# EAGLE design control pcb rev1-1 (EAGLE 6.1)

## Sheet 1 of 6
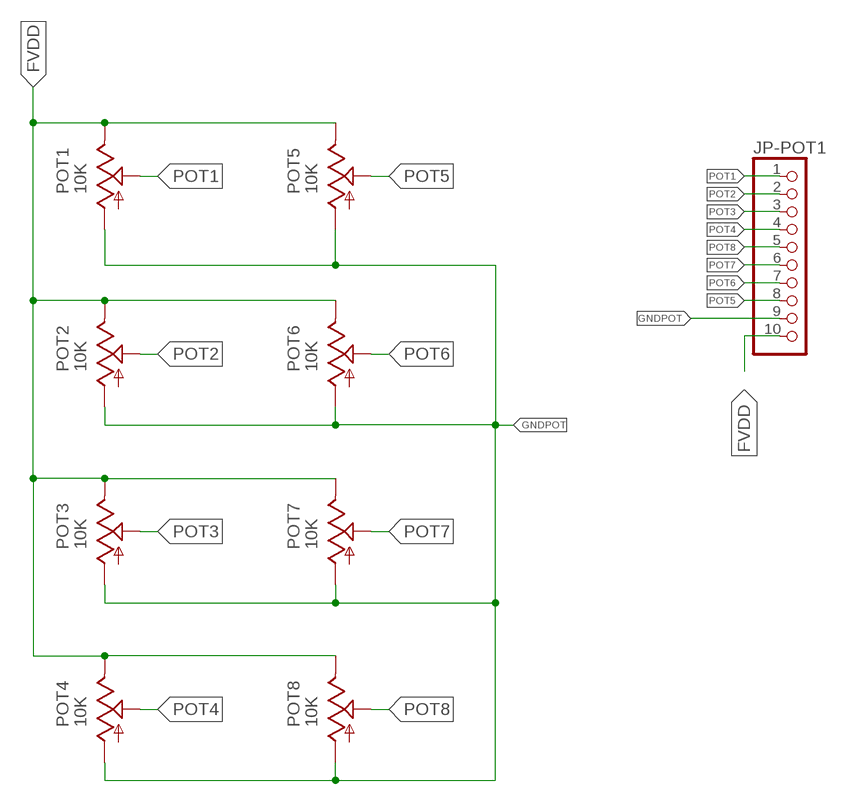
[diagram p0: schematic, sheet 1]

### Parts
JP-POT1  PINHD-1X10_2.54  [1X10]
POT1  10K  9MM_SNAP-IN_POT_  [9MM_SNAP-IN_POT]
POT2  10K  9MM_SNAP-IN_POT_  [9MM_SNAP-IN_POT]
POT3  10K  9MM_SNAP-IN_POT_  [9MM_SNAP-IN_POT]
POT4  10K  9MM_SNAP-IN_POT_  [9MM_SNAP-IN_POT]
POT5  10K  9MM_SNAP-IN_POT_  [9MM_SNAP-IN_POT]
POT6  10K  9MM_SNAP-IN_POT_  [9MM_SNAP-IN_POT]
POT7  10K  9MM_SNAP-IN_POT_  [9MM_SNAP-IN_POT]
POT8  10K  9MM_SNAP-IN_POT_  [9MM_SNAP-IN_POT]

### Nets
FVDD: JP-POT1.10 POT1.3(E) POT2.3(E) POT3.3(E) POT4.3(E) POT5.3(E) POT6.3(E) POT7.3(E) POT8.3(E)
GNDPOT: JP-POT1.9 POT1.1(A) POT2.1(A) POT3.1(A) POT4.1(A) POT5.1(A) POT6.1(A) POT7.1(A) POT8.1(A)
POT1: JP-POT1.1 POT1.2(S)
POT2: JP-POT1.2 POT2.2(S)
POT3: JP-POT1.3 POT3.2(S)
POT4: JP-POT1.4 POT4.2(S)
POT5: JP-POT1.8 POT5.2(S)
POT6: JP-POT1.7 POT6.2(S)
POT7: JP-POT1.6 POT7.2(S)
POT8: JP-POT1.5 POT8.2(S)

## Sheet 2 of 6
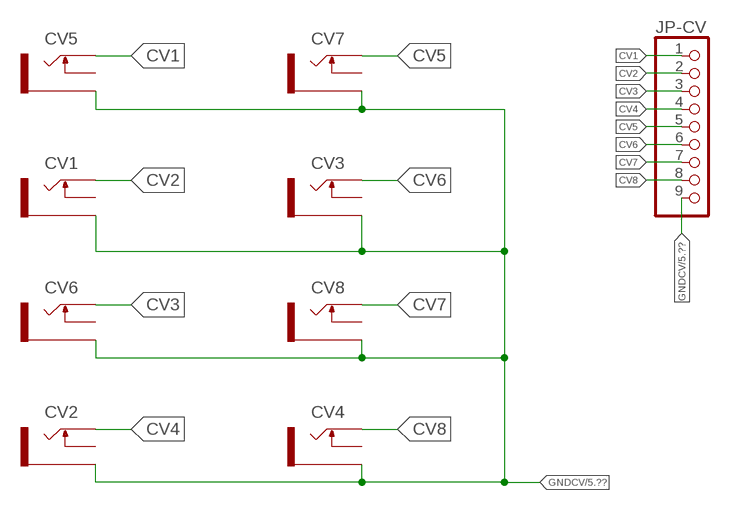
[diagram p1: schematic, sheet 2]

### Parts
CV1  THONKICONNNEW  [WQP-PJ301M-12_JACK]
CV2  THONKICONNNEW  [WQP-PJ301M-12_JACK]
CV3  THONKICONNNEW  [WQP-PJ301M-12_JACK]
CV4  THONKICONNNEW  [WQP-PJ301M-12_JACK]
CV5  THONKICONNNEW  [WQP-PJ301M-12_JACK]
CV6  THONKICONNNEW  [WQP-PJ301M-12_JACK]
CV7  THONKICONNNEW  [WQP-PJ301M-12_JACK]
CV8  THONKICONNNEW  [WQP-PJ301M-12_JACK]
JP-CV  PINHD-1X9_2.54  [1X09]

### Nets
CV1: CV5.P$1_TIP(TIP) JP-CV.1
CV2: CV1.P$1_TIP(TIP) JP-CV.2
CV3: CV6.P$1_TIP(TIP) JP-CV.3
CV4: CV2.P$1_TIP(TIP) JP-CV.4
CV5: CV7.P$1_TIP(TIP) JP-CV.5
CV6: CV3.P$1_TIP(TIP) JP-CV.6
CV7: CV8.P$1_TIP(TIP) JP-CV.7
CV8: CV4.P$1_TIP(TIP) JP-CV.8
GNDCV: CV1.P$3_SLEEVE(SLEEVE) CV2.P$3_SLEEVE(SLEEVE) CV3.P$3_SLEEVE(SLEEVE) CV4.P$3_SLEEVE(SLEEVE) CV5.P$3_SLEEVE(SLEEVE) CV6.P$3_SLEEVE(SLEEVE) CV7.P$3_SLEEVE(SLEEVE) CV8.P$3_SLEEVE(SLEEVE) JP-CV.9 ; also sheet 5
Unconnected: CV1.P$2_SWITCH(SWITCH) CV2.P$2_SWITCH(SWITCH) CV3.P$2_SWITCH(SWITCH) CV4.P$2_SWITCH(SWITCH) CV5.P$2_SWITCH(SWITCH) CV6.P$2_SWITCH(SWITCH) CV7.P$2_SWITCH(SWITCH) CV8.P$2_SWITCH(SWITCH)

## Sheet 3 of 6
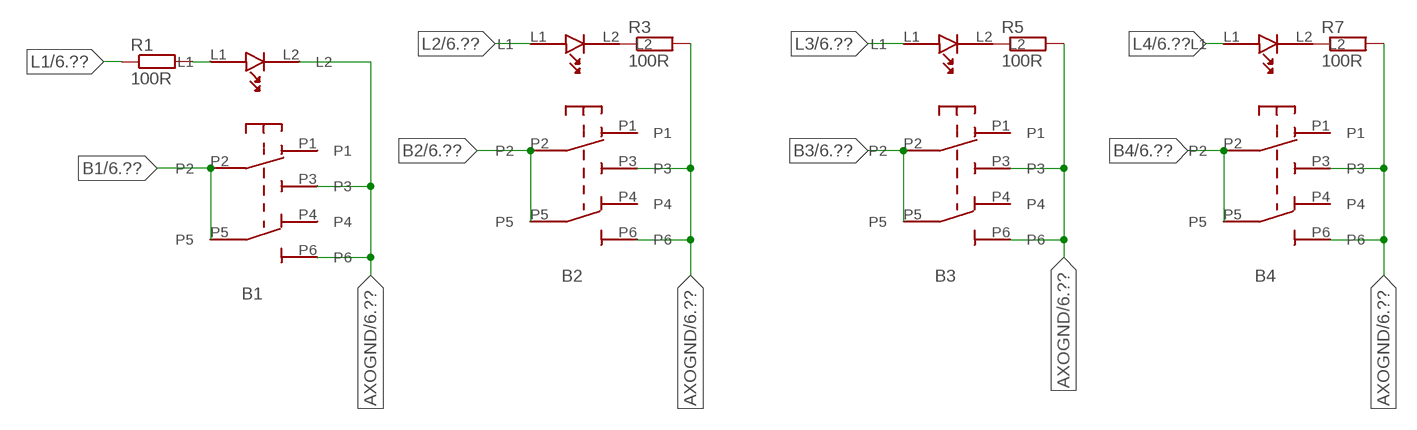
[diagram p2: schematic, sheet 3]

### Parts
B1  LP4OA1PBCTG/D6  LP4OA1PBCTG  [LP4OA1PBCT]
B2  LP4OA1PBCTG/D6  LP4OA1PBCTG  [LP4OA1PBCT]
B3  LP4OA1PBCTG/D6  LP4OA1PBCTG  [LP4OA1PBCT]
B4  LP4OA1PBCTG/D6  LP4OA1PBCTG  [LP4OA1PBCT]
R1  100R  R-EU_0207/7  [0207/7]
R3  100R  R-EU_0207/7  [0207/7]
R5  100R  R-EU_0207/7  [0207/7]
R7  100R  R-EU_0207/7  [0207/7]

### Nets
AXOGND: B1.L2 B1.P3 B1.P6 B2.P3 B2.P6 B3.P3 B3.P6 B4.P3 B4.P6 R3.2 R5.2 R7.2 ; also sheet 6
B1: B1.P2 B1.P5 ; also sheet 6
B2: B2.P2 B2.P5 ; also sheet 6
B3: B3.P2 B3.P5 ; also sheet 6
B4: B4.P2 B4.P5 ; also sheet 6
L1: R1.1 ; also sheet 6
L2: B2.L1 ; also sheet 6
L3: B3.L1 ; also sheet 6
L4: B4.L1 ; also sheet 6
N$3: B2.L2 R3.1
N$4: B3.L2 R5.1
N$5: B1.L1 R1.2
N$6: B4.L2 R7.1
Unconnected: B1.P1 B1.P4 B2.P1 B2.P4 B3.P1 B3.P4 B4.P1 B4.P4

## Sheet 4 of 6
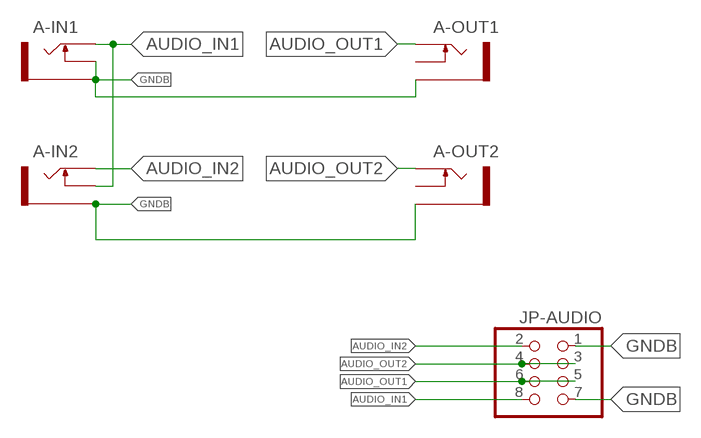
[diagram p3: schematic, sheet 4]

### Parts
A-IN1  THONKICONNNEW  [WQP-PJ301M-12_JACK]
A-IN2  THONKICONNNEW  [WQP-PJ301M-12_JACK]
A-OUT1  THONKICONNNEW  [WQP-PJ301M-12_JACK]
A-OUT2  THONKICONNNEW  [WQP-PJ301M-12_JACK]
JP-AUDIO  PINHD-2X4_2.54  [2X04]

### Nets
AUDIO_IN1: A-IN1.P$1_TIP(TIP) A-IN2.P$2_SWITCH(SWITCH) JP-AUDIO.8
AUDIO_IN2: A-IN2.P$1_TIP(TIP) JP-AUDIO.2
AUDIO_OUT1: A-OUT1.P$1_TIP(TIP) JP-AUDIO.5 JP-AUDIO.6
AUDIO_OUT2: A-OUT2.P$1_TIP(TIP) JP-AUDIO.3 JP-AUDIO.4
GNDB: A-IN1.P$2_SWITCH(SWITCH) A-IN1.P$3_SLEEVE(SLEEVE) A-IN2.P$3_SLEEVE(SLEEVE) A-OUT1.P$3_SLEEVE(SLEEVE) A-OUT2.P$3_SLEEVE(SLEEVE) JP-AUDIO.1 JP-AUDIO.7
Unconnected: A-OUT1.P$2_SWITCH(SWITCH) A-OUT2.P$2_SWITCH(SWITCH)

## Sheet 5 of 6
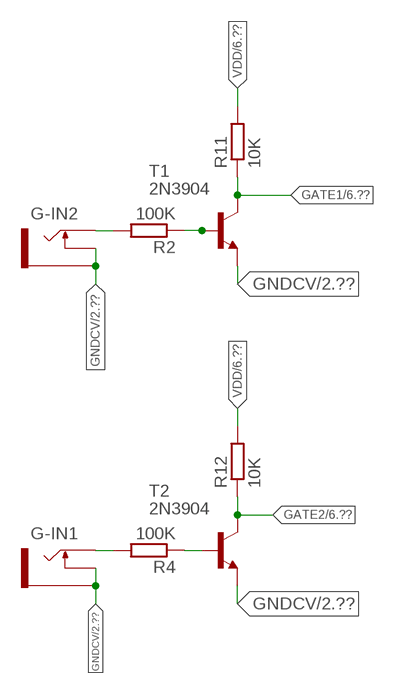
[diagram p4: schematic, sheet 5]

### Parts
G-IN1  THONKICONNNEW  [WQP-PJ301M-12_JACK]
G-IN2  THONKICONNNEW  [WQP-PJ301M-12_JACK]
R2  100K  R-EU_0207/7  [0207/7]
R4  100K  R-EU_0207/7  [0207/7]
R11  10K  R-EU_0207/7  [0207/7]
R12  10K  R-EU_0207/7  [0207/7]
T1  2N3904  [TO92]
T2  2N3904  [TO92]

### Nets
GATE1: R11.1 T1.1(C) ; also sheet 6
GATE2: R12.1 T2.1(C) ; also sheet 6
GNDCV: G-IN1.P$2_SWITCH(SWITCH) G-IN1.P$3_SLEEVE(SLEEVE) G-IN2.P$2_SWITCH(SWITCH) G-IN2.P$3_SLEEVE(SLEEVE) T1.3(E) T2.3(E) ; also sheet 2
N$7: G-IN2.P$1_TIP(TIP) R2.2
N$9: G-IN1.P$1_TIP(TIP) R4.2
N$11: R2.1 T1.2(B)
N$16: R4.1 T2.2(B)
VDD: R11.2 R12.2 ; also sheet 6

## Sheet 6 of 6
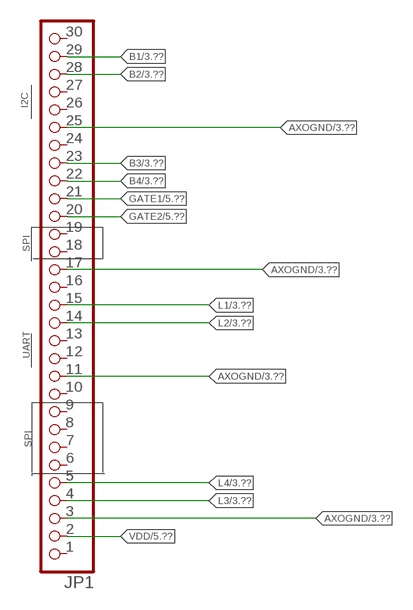
[diagram p5: schematic, sheet 6]

### Parts
JP1  PINHD-1X30  [1X30]

### Nets
AXOGND: JP1.3 JP1.11 JP1.17 JP1.25 ; also sheet 3
B1: JP1.29 ; also sheet 3
B2: JP1.28 ; also sheet 3
B3: JP1.23 ; also sheet 3
B4: JP1.22 ; also sheet 3
GATE1: JP1.21 ; also sheet 5
GATE2: JP1.20 ; also sheet 5
L1: JP1.15 ; also sheet 3
L2: JP1.14 ; also sheet 3
L3: JP1.4 ; also sheet 3
L4: JP1.5 ; also sheet 3
VDD: JP1.2 ; also sheet 5
Unconnected: JP1.1 JP1.6 JP1.7 JP1.8 JP1.9 JP1.10 JP1.12 JP1.13 JP1.16 JP1.18 JP1.19 JP1.24 JP1.26 JP1.27 JP1.30

### Notes on the sheet
- I2C
- SPI
- UART
- SPI

## Library data of the parts
A-IN1 A-IN2 A-OUT1 A-OUT2 CV1-CV8 G-IN1 G-IN2 = MusicThingModular:THONKICONN: 3.5mm socket for Eurorack modular synths
B1-B4 = og-switch:LP4OA1PBCTG
JP1 = pinhead:PINHD-1X30: PIN HEADER
JP-AUDIO = pinhead 2:PINHD-2X4: PIN HEADER
JP-CV = pinhead 2:PINHD-1X9: PIN HEADER
JP-POT1 = pinhead 2:PINHD-1X10: PIN HEADER
POT1-POT8 = MusicThingModular:9MM_SNAP-IN_POT: 9mm vertical snap-in pot, Alpha / Panasonic style
R1-R5 R7 R11 R12 = resistor-mod:R-EU_: RESISTOR, European symbol
T1 T2 = transistor-mod:2N3904: NPN TRANSISTOR

## Board
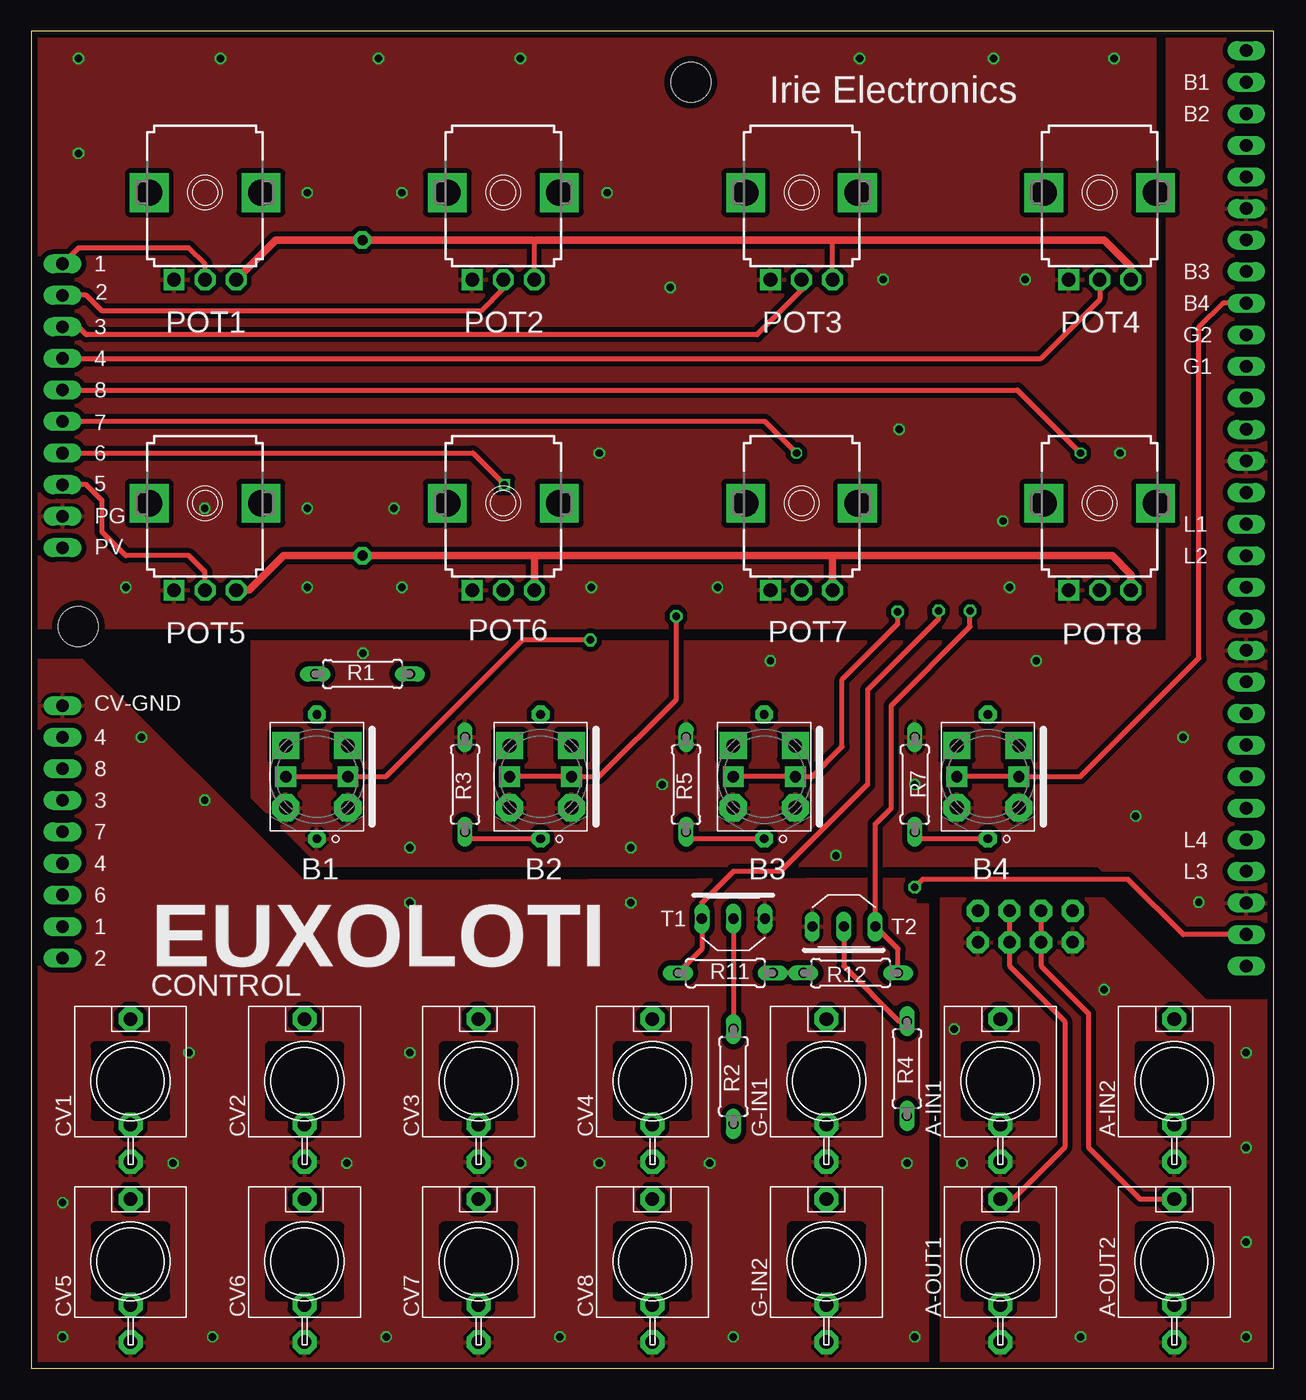
[diagram p6: board, top side]
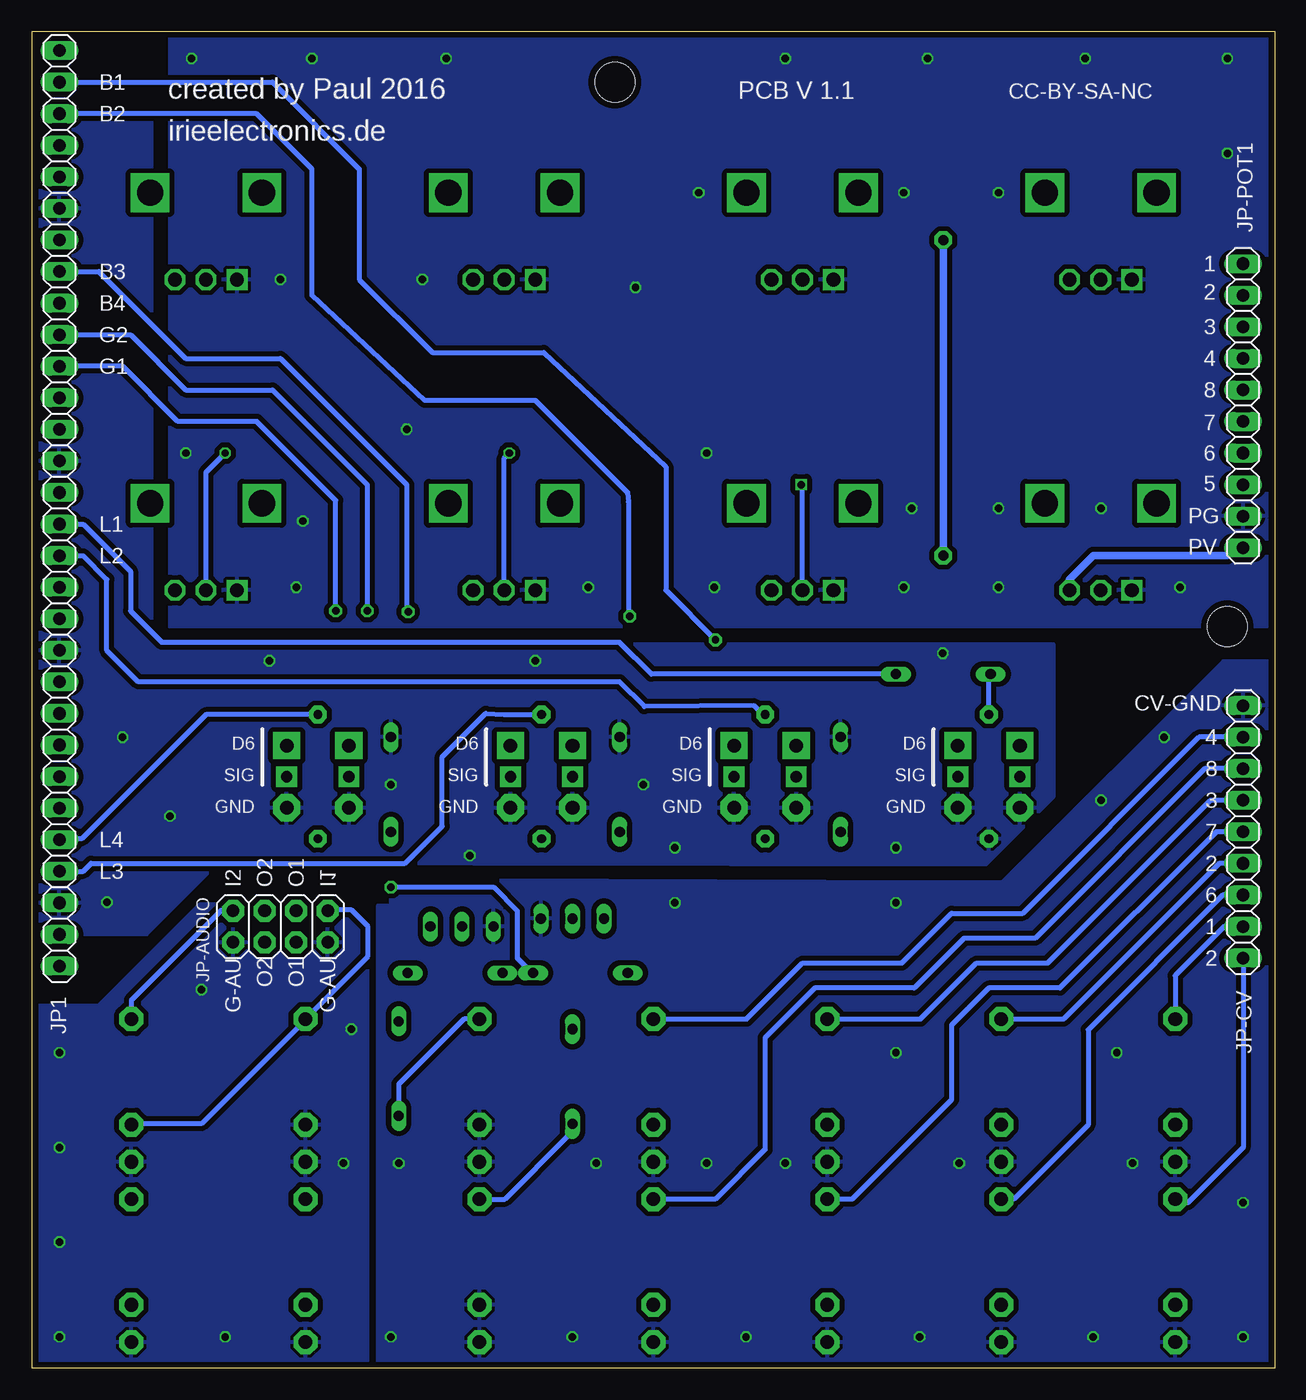
[diagram p7: board, bottom side, seen from below]

Size 100 x 107.62 mm. Coordinates in mm from the lower left corner, seen from the top.
Outline: 0,0 100,0 100,107.62 0,107.62 0,0
Copper layers (1*2*15*16): Top 0.035mm / dielectric 0.2mm / Route2 0.035mm / dielectric 1.2mm / Route15 0.035mm / dielectric 0.2mm / Bottom 0.035mm
Design rules: minimum track width 6mil, minimum drill 12mil, track to track 6mil, track to pad 8mil, pad to pad 12mil, via to via 6mil, smd to smd 0mil, copper to edge 20mil, drill to drill 10mil, minimum pad ring 6mil, minimum via ring 6mil, stop-mask expansion 0mil, vias tented up to drill 100mil, thermal gap 10mil
Holes 3.2 mm at 53.1,103.51 3.81,59.69

### Footprints (pad centres in the part's own frame; a part is rotated, then mirrored left to right if it is on the bottom)
WQP-PJ301M-12_JACK = drill 1.1 pad 1.93 octagon: P$1_TIP 0,5; P$2_SWITCH 0,-3.5; P$3_SLEEVE 0,-6.5
LP4OA1PBCT = drill 0.7 pad 1.422 octagon: L1 5,0; L2 -5,0 | drill 1.1 pad 2.184 square: P1 2.5,2.5; P4 2.5,-2.5 | drill 0.9 pad 1.676 square: P2 0,2.5; P5 0,-2.5 | drill 1.1 pad 2.184 octagon: P3 -2.5,2.5; P6 -2.5,-2.5
1X30 = drill 1.016 long: 1 -36.83,0; 2 -34.29,0; 3 -31.75,0; 4 -29.21,0; 5 -26.67,0; 6 -24.13,0; 7 -21.59,0; 8 -19.05,0; 9 -16.51,0; 10 -13.97,0; 11 -11.43,0; 12 -8.89,0; 13 -6.35,0; 14 -3.81,0; 15 -1.27,0; 16 1.27,0; 17 3.81,0; 18 6.35,0; 19 8.89,0; 20 11.43,0; 21 13.97,0; 22 16.51,0; 23 19.05,0; 24 21.59,0; 25 24.13,0; 26 26.67,0; 27 29.21,0; 28 31.75,0; 29 34.29,0; 30 36.83,0
2X04 = drill 1.016 pad 1.778 octagon: 1 -3.81,-1.27; 2 -3.81,1.27; 3 -1.27,-1.27; 4 -1.27,1.27; 5 1.27,-1.27; 6 1.27,1.27; 7 3.81,-1.27; 8 3.81,1.27
1X09 = drill 1.016 long: 1 -10.16,0; 2 -7.62,0; 3 -5.08,0; 4 -2.54,0; 5 0,0; 6 2.54,0; 7 5.08,0; 8 7.62,0; 9 10.16,0
1X10 = drill 1.016 long: 1 -11.43,0; 2 -8.89,0; 3 -6.35,0; 4 -3.81,0; 5 -1.27,0; 6 1.27,0; 7 3.81,0; 8 6.35,0; 9 8.89,0; 10 11.43,0
9MM_SNAP-IN_POT = drill 1.1 pad 1.676 square: 1 -2.5,-7 | drill 1.1 pad 1.676 octagon: 2 0,-7; 3 2.5,-7 | drill 2.1 pad 2.8 square: CHASSIS1 -4.5,0; CHASSIS2 4.5,0
0207/7 = drill 0.813 long: 1 -3.81,0; 2 3.81,0
TO92 = drill 0.813 long: 1 2.54,0; 2 0,0; 3 -2.54,0

### Placement (x,y rotation side)
A-IN1  78,23.12 0 top
A-IN2  92,23.12 0 top
A-OUT1  78,8.62 0 top
A-OUT2  92,8.62 0 top
B1  23,47.62 90 top
B2  41,47.62 90 top
B3  59,47.62 90 top
B4  77,47.62 90 top
CV1  8,23.12 0 top
CV2  22,23.12 0 top
CV3  36,23.12 0 top
CV4  50,23.12 0 top
CV5  8,8.62 0 top
CV6  22,8.62 0 top
CV7  36,8.62 0 top
CV8  50,8.62 0 top
G-IN1  64,23.12 0 top
G-IN2  64,8.62 0 top
JP1  97.79,69.22 90 bottom
JP-AUDIO  80.01,35.56 0 bottom
JP-CV  2.54,43.18 90 bottom
JP-POT1  2.54,77.47 270 bottom
POT1  14,94.62 0 top
POT2  38,94.62 0 top
POT3  62,94.62 0 top
POT4  86,94.62 0 top
POT5  14,69.62 0 top
POT6  38,69.62 0 top
POT7  62,69.62 0 top
POT8  86,69.62 0 top
R1  26.67,55.88 180 top
R2  56.52,23.5 270 top
R3  34.92,46.99 90 top
R4  70.48,24.13 270 top
R5  52.7,46.99 90 top
R7  71.12,46.99 90 top
R11  55.87,31.82 0 top
R12  65.95,31.82 180 top
T1  56.52,36.2 180 top
T2  65.41,35.56 0 top

### Tracks (layer width: path | path; a pad name or v marks a point on that pad's centre or on a via)
AUDIO_IN1
  Bottom 0.406: A-IN2.P$2_SWITCH 91.94,19.68 86.36,19.68 78,28.05 A-IN1.P$1_TIP 73,33.12 73,35.62 74.27,36.89 76.14,36.89 JP-AUDIO.8 76.2,36.88
AUDIO_IN2
  Bottom 0.406: A-IN2.P$1_TIP 92,29.62 84.73,36.89 83.88,36.89 JP-AUDIO.2 83.82,36.88
AUDIO_OUT1
  Top 0.406: A-OUT1.P$1_TIP 79.03,13.62 83.19,17.78 83.19,27.94 78.73,32.39 JP-AUDIO.5 JP-AUDIO.6
AUDIO_OUT2
  Top 0.406: A-OUT2.P$1_TIP 89.25,13.62 85.09,17.78 85.09,28.57 81.27,32.39 JP-AUDIO.3 JP-AUDIO.4
AXOGND  (via drill 0.6)
  other vias: 64.77,41.27 48.26,41.91 50.8,46.99 30.48,41.91 71.12,46.99 80.9,56.95 59.5,56.95 26.7,57.55 88.9,44.45 93.97,37.52 92.71,50.8
  pour Bottom (isolate 0.406): 17.81,58.31 17.81,45.98 23.29,40.5 85.09,40.64 90.81,34.92 91.44,34.92 100.01,34.92 100.01,107.63 90.42,107.63 90.42,58.31
  pour Top (isolate 0.406): 17.81,58.31 17.81,45.98 23.29,40.5 85.86,40.5 87,39.37 90.81,34.92 99.69,34.92 99.69,107.31 91.44,107.31 91.44,58.42 17.78,58.42
B1  (via drill 0.6 pad 1.02)
  Top 0.406: B1.P2 B1.P5 28.57,47.62 39.57,58.62 v45,58.62
  Bottom 0.406: v45,58.62 49,62.62 49,72.57 58.81,81.75 67.78,81.75 73.66,87.63 73.66,96.52 80.64,103.51 JP1.29
B2  (via drill 0.6 pad 1.02)
  Top 0.406: B2.P2 B2.P5 45.72,47.62 51.91,53.81 v51.91,60.52
  Bottom 0.406: v51.91,60.52 52,60.62 52,69.75 52.07,70.48 59.51,77.92 68.39,77.92 77.47,86.36 77.47,96.52 81.92,100.97 JP1.28
B3  (via drill 0.6 pad 1.02)
  Top 0.406: v69.73,60.89 69.73,59.89 65.27,55.43 65.27,50.03 62.87,47.62 62,47.62 B3.P5 B3.P2
  Bottom 0.406: JP1.23 94.61,88.27 87.63,81.28 80.01,81.28 69.85,71.12 69.85,61.01 v69.73,60.89
B4
  Top 0.406: B4.P2 B4.P5 84.45,47.62 93.98,57.15 93.98,83.82 95.89,85.73 JP1.22
CV1
  Bottom 0.406: CV5.P$1_TIP 7.62,13.97 6.99,13.34 2.54,17.78 JP-CV.1
CV2
  Bottom 0.406: CV1.P$1_TIP 8,31.62 4.06,35.56 JP-CV.2
CV3
  Bottom 0.406: CV6.P$1_TIP 21,13.62 15,19.62 15,27.26 4.16,38.1 JP-CV.3
CV4
  Bottom 0.406: CV2.P$1_TIP 16.96,28.12 4.45,40.64 JP-CV.4
CV5
  Bottom 0.406: CV7.P$1_TIP 34,13.62 26,21.62 26,27.62 23,30.62 17.27,30.62 5.07,42.82 4.71,43.18 JP-CV.5
CV6
  Bottom 0.406: CV3.P$1_TIP 28.5,28.12 24,32.62 18.27,32.62 5.17,45.72 JP-CV.6
CV7
  Bottom 0.406: CV8.P$1_TIP 45,13.62 41,17.62 41,26.62 37,30.62 29,30.62 25,34.62 19.27,34.62 5.63,48.26 JP-CV.7
CV8
  Bottom 0.406: CV4.P$1_TIP 42.5,28.12 38,32.62 30,32.62 26,36.62 20.27,36.62 6.09,50.8 JP-CV.8
FVDD  (via drill 0.8 pad 1.42)
  Top 0.406: POT3.3 64.5,90.81 | POT2.3 40.5,90.67 40.64,90.81
  Top 0.61: 64.5,65.41 40.64,65.41 | 40.64,65.41 v26.67,65.41 20.32,65.41 17.54,62.62 POT5.3 | 64.5,65.41 POT7.3 | POT1.3 19.68,90.81 v26.67,90.81 40.36,90.81 40.5,90.67 | 40.64,90.81 64.5,90.81 86.36,90.81 88.5,88.67 POT4.3 | POT6.3 40.5,65.27 40.64,65.41 | POT8.3 88.5,63.9 87,65.41 64.5,65.41
  Bottom 0.61: POT5.3 16.51,63.5 14.61,65.41 3.81,65.41 3.17,66.04 JP-POT1.10 | v26.67,65.41 v26.67,90.81
GATE1  (via drill 0.6 pad 1.02)
  Top 0.406: R11.1 53.98,33.74 T1.1 53.98,37.46 56.52,40 60.33,40 67.31,46.99 67.31,54.61 73.03,60.32 v73.03,60.96
  Bottom 0.406: JP1.21 92.08,83.19 87.63,78.74 80.64,78.74 73.03,71.12 v73.03,60.96
GATE2  (via drill 0.6 pad 1.02)
  Top 0.406: R12.1 69.77,33.74 T2.1 67.94,43.81 69.22,45.09 69.22,53.34 75.56,59.69 v75.56,60.96
  Bottom 0.406: v75.56,60.96 75.56,69.85 81.92,76.2 88.27,76.2 92.71,80.65 JP1.20
GNDB  (via drill 0.6)
  other vias: 74.93,16.51 97.79,25.4 97.79,17.78 97.79,10.16 86.36,30.48 74.3,27.3 97.79,2.54 84.45,2.54
  pour Bottom (isolate 0.406): 73.03,37.37 73.03,0.63 99.69,0.63 99.69,29.21 94.61,29.21 86.46,37.37
  pour Top (isolate 0.406): 73.25,37.76 73.25,0.63 100.01,0.63 100.01,29.54 94.53,29.54 86.31,37.76
GNDCV  (via drill 0.6)
  other vias: 11.43,16.51 25.4,16.51 39.37,16.51 45.72,16.51 54.61,16.51 8.89,50.8 13.97,45.72 30.48,25.4 12.7,25.4 30.48,37.46 2.54,2.54 14.61,2.54 28.57,2.54 42.55,2.54 56.52,2.54 2.54,13.34 48.26,37.46 70.48,16.51 71.12,2.54
  pour Bottom (isolate 0.406): 0,56.94 0,0 72.14,0 72.14,37.26 71.12,37.26 71.12,39.37 27.4,39.13 21.92,39.13 4.11,56.94
  pour Top (isolate 0.406): 0.64,56.94 0.64,0 72.14,0 72.14,37.26 71.12,37.26 71.12,39.37 27.4,39.13 21.92,39.13 4.11,56.94
GNDPOT  (via drill 0.6)
  other vias: 3.81,97.79 22.23,94.62 29.84,94.62 46.35,94.62 69.85,75.56 80.01,87.63 45.72,73.66 22.23,69.22 29.21,69.22 22.23,62.86 13.97,69.22 7.62,62.86 87.63,73.66 78.74,62.86 68.58,87.63 51.44,87 39.37,105.41 77.47,105.41 66.67,105.41 78.21,68.19 27.94,105.41 15.24,105.41 3.81,105.41 87.16,105.41 45.09,62.86 55.24,62.86 29.84,62.86
  pour Bottom (isolate 0.406): 0.64,107.31 0.64,59.69 88.9,59.69 88.9,107.31
  pour Top (isolate 0.406): 0,107.63 0,59.68 90.42,59.68 90.42,107.63
L1
  Bottom 0.406: JP1.15 95.89,67.95 92.08,64.14 92.08,60.96 89.53,58.42 52.7,58.42 50.16,55.88 R1.1
L2
  Bottom 0.406: B2.L1 41.19,52.62 41.91,53.34 50.72,53.25 52.7,55.24 91.44,55.24 93.98,57.78 93.98,63.5 95.89,65.41 JP1.14
L3
  Bottom 0.406: JP1.4 95.89,40 95.25,40.64 69.98,40.64 67,43.62 67,49.2 63.5,52.7 62,52.62 B3.L1
L4
  Bottom 0.406: B4.L1 86,52.62 96,42.62 97.72,42.62 JP1.5
N$3
  Top 0.406: B2.L2 35,42.62 R3.1
N$4
  Top 0.406: B3.L2 52.78,42.62 R5.1
N$5
  Bottom 0.406: B1.L1 23,55.74 R1.2
N$6
  Top 0.406: B4.L2 71.19,42.62 R7.1
N$7
  Bottom 0.406: 56.34,20.23 56.54,19.7 | 56.54,19.7 56.97,18.59 61.95,13.62 G-IN2.P$1_TIP | R2.2 56.53,19.68 56.54,19.7
N$9
  Bottom 0.406: G-IN1.P$1_TIP 65.22,28.12 70.48,22.86 R4.2
N$11
  Top 0.406: T1.2 R2.1
N$16
  Top 0.406: T2.2 65.41,32.38 69.85,27.94 R4.1
POT1
  Top 0.406: POT1.2 14,88.87 12.7,90.17 3.81,90.17 JP-POT1.1
POT2
  Top 0.406: POT2.2 38,86.9 36.2,85.09 5.71,85.09 4.45,86.36 JP-POT1.2
POT3
  Top 0.406: POT3.2 62,86.77 58.42,83.19 4.45,83.19 3.81,83.82 JP-POT1.3
POT4
  Top 0.406: JP-POT1.4 81.28,81.28 86,86 POT4.2
POT5
  Top 0.406: POT5.2 14,64.11 12.7,65.41 7.62,65.41 5.71,67.31 5.71,69.85 4.45,71.12 JP-POT1.8
POT6  (via drill 0.6)
  Top 0.406: JP-POT1.7 35.56,73.66 v38.1,71.12
  Bottom 0.406: POT6.2 38,71.02 v38.1,71.12
POT7  (via drill 0.6)
  Top 0.406: v61.59,73.66 59.05,76.2 JP-POT1.6
  Bottom 0.406: POT7.2 62,73.26 v61.59,73.66
POT8  (via drill 0.6)
  Top 0.406: JP-POT1.5 79.38,78.74 v84.45,73.66
  Bottom 0.406: POT8.2 86,72.12 v84.45,73.66
VDD  (via drill 0.6 pad 1.02)
  Top 0.406: R12.2 R11.2 | JP1.2 92.71,34.92 88.27,39.37 71.75,39.37 v71.12,38.73
  Bottom 0.406: v71.12,38.73 62.87,38.73 60.96,36.83 60.96,33.02 59.69,31.75 59.68,31.76 R11.2

### Text on the board
bPlace: I1
tNames: B1 | Irie Electronics | B2 | 1 | B3 | 2 | B4 | 3 | G2 | 4 | G1 | 8 | 7 | 6 | 5 | PG | L1 | PV | L2 | CV-GND | 4 | 8 | 3 | 7 | L4 | 4 | L3 | 6 | 1 | 2 | EUXOLOTI | CONTROL
bNames: CC-BY-SA-NC | PCB V 1.1 | created by Paul 2016 | B1 | B2 | irieelectronics.de | 1 | B3 | 2 | B4 | 3 | G2 | 4 | G1 | 8 | 7 | 6 | 5 | PG | L1 | PV | L2 | CV-GND | 4 | 8 | 3 | 7 | L4 | 2 | L3 | O1 | O2 | I2 | 6 | 1 | 2 | G-AU | O1 | O2 | G-AU